# Altium project HealcareSystem.PrjPcb
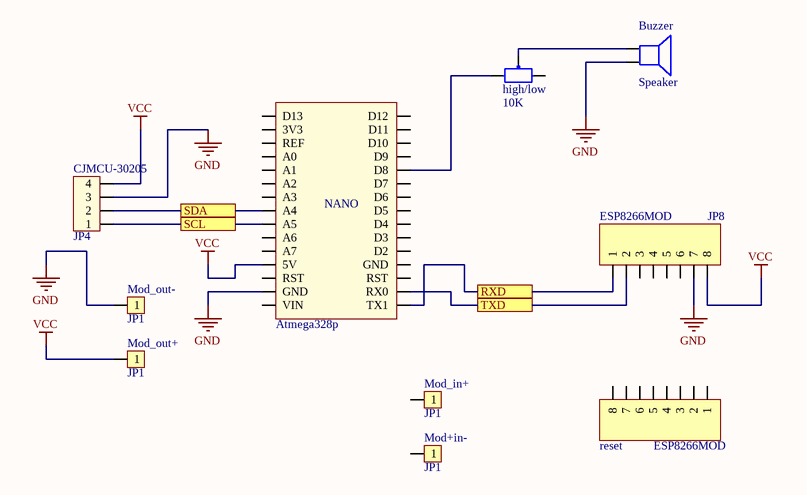
[diagram p0: HealcareSystem.SchDoc]
1 sheet, 10 parts. Net scope: flat (ports and power ports of the same name join across sheets).
Board file: HealcareSystem.PcbDoc

## Sheet HealcareSystem.SchDoc
size A; SheetNumber: 1; SheetTotal: 1

### Parts
Atmega328p  Arduino Nano  [Arduino Nano]  (value not drawn)
Buzzer  Speaker  [SPEAKER]
CJMCU-30205  JP4  [CON4]
ESP8266MOD  JP8  [JP8-C1T]
high/low  10K  [VR]
Mod+in-  JP1  [JP1-D1T]
Mod_in+  JP1  [JP1-D1T]
Mod_out+  JP1  [JP1-D1T]
Mod_out-  JP1  [JP1-D1T]
reset  ESP8266MOD  [JP8-C1T]

### Ports
RXD, SCL, SDA, TXD

### Nets
GND: Atmega328p.GND Buzzer.2 CJMCU-30205.3 ESP8266MOD.7 Mod_out-.1
VCC: Atmega328p.5V CJMCU-30205.4 ESP8266MOD.8 Mod_out+.1
NetAtmega328p_A4: Atmega328p.A4 CJMCU-30205.2 ; port SDA
NetAtmega328p_A5: Atmega328p.A5 CJMCU-30205.1 ; port SCL
NetAtmega328p_D8: Atmega328p.D8 high/low.1
NetAtmega328p_RX0: Atmega328p.RX0 ESP8266MOD.2 ; port TXD
NetAtmega328p_TX1: Atmega328p.TX1 ESP8266MOD.1 ; port RXD
NetBuzzer_1: Buzzer.1 high/low.2

Not connected (* = marked no-connect by the designer): Atmega328p 3V3 A0 A1 A2 A3 A6 A7 D2 D3 D4 D5 D6 D7 D9 D10 D11 D12 D13 REF RST VIN; ESP8266MOD 3 4 5 6; high/low 3; Mod+in- 1; Mod_in+ 1; reset 1 2 3 4 5 6 7 8

### Notes on the sheet
- (in symbol Arduino Nano) NANO

### Library data of the parts
Atmega328p = Arduino Nano: Value: Cau 1A
Buzzer = Speaker: Loudspeaker; Published: 24-Mar-1999; LatestRevisionDate: 17-Jul-2002; LatestRevisionNote: Re-released for DXP Platform.; PackageReference: PIN2; Publisher: Altium Limited
CJMCU-30205 = Con4: Connector 4; Value: Connector 4
ESP8266MOD reset = JP8: WR-PHD 2.54 mm Angled Socket Header; Manufacturer: W¨¹rth Elektronik eiSos GmbH; partNo: 613008143121; ComponentLink1 Description: Manufacturer; ComponentLink2 Description: Datasheet; NoPins: 08; Created Date: 29 March 2013; ComponentLink1URL: http://www.we-online.com; ComponentLink2URL: http://katalog.we-online.de/em/datasheet/6130xx143121.pdf; Created by: Karrer Zheng
high/low = VR: Var Resistor; Value: VR 10K
Mod+in- Mod_in+ Mod_out+ Mod_out- = JP1: WR-PHD 2.54 mm Angled Socket Header; Manufacturer: W¨¹rth Elektronik eiSos GmbH; partNo: 613002143121; ComponentLink1 Description: Manufacturer; ComponentLink2 Description: Datasheet; NoPins: 02; Created Date: 29 March 2013; ComponentLink1URL: http://www.we-online.com; ComponentLink2URL: http://katalog.we-online.de/em/datasheet/6130xx143121.pdf; Created by: Karrer Zheng